# Altium schematic sheet FPGA_Connectors.SchDoc: Audio Research: FMC Connector
size A4; DrawnBy: Connor Dack; Engineer: Connor Dack; DocumentNumber: 4; Revision: 0.0; SheetNumber: 4; SheetTotal: 13
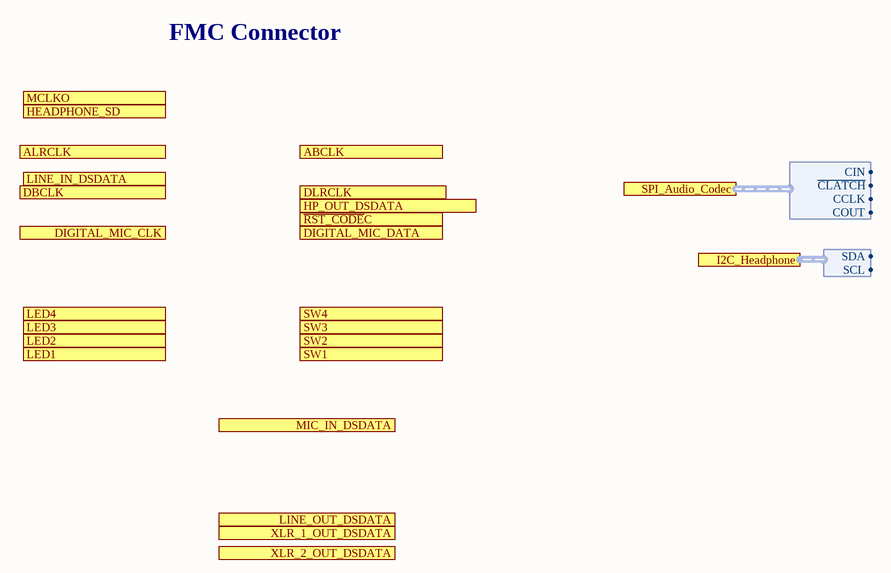
[diagram p0: FPGA_Connectors.SchDoc]

## Ports
ABCLK (in), ALRCLK (in), DBCLK (out), DIGITAL_MIC_CLK (out), DIGITAL_MIC_DATA (in), DLRCLK (out), HEADPHONE_SD (out), HP_OUT_DSDATA (in), I2C_Headphone (harness I2C_Headphone), LED1 (out), LED2 (out), LED3 (out), LED4 (out), LINE_IN_DSDATA (in), LINE_OUT_DSDATA (out), MCLKO (in), MIC_IN_DSDATA (in), SPI_Audio_Codec (harness SPI_Audio_Codec), SW1 (in), SW2 (in), SW3 (in), SW4 (in), XLR_1_OUT_DSDATA (out), XLR_2_OUT_DSDATA (out), ~{RST_CODE}C (out)

## Harnesses
SPI_Audio_Codec: CIN, COUT, CCLK, ~{CLATCH}
I2C_Headphone: SDA, SCL

## Notes on the sheet
- FMC Connector
- Title:
- Sheet:
- of
- Size:
- A4
- Rev:
- Date:
- Engineer:
- Time:
- File: